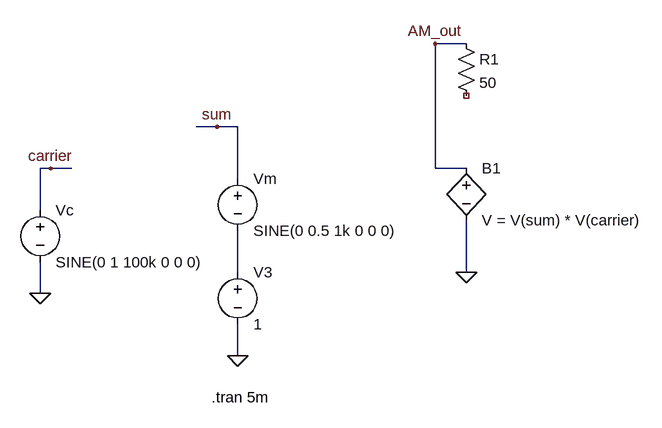
[diagram p0: schematic exp9.asc]
exp9.asc, the LTspice schematic file:
Version 4.1
SHEET 1 1004 680
WIRE 704 -160 656 -160
WIRE 320 -32 288 -32
WIRE 352 -32 320 -32
WIRE 64 32 48 32
WIRE 96 32 64 32
WIRE 656 32 656 -160
WIRE 704 32 656 32
WIRE 352 48 352 -32
WIRE 48 96 48 32
WIRE 352 192 352 128
WIRE 704 192 704 112
WIRE 48 224 48 176
WIRE 352 320 352 272
FLAG 48 224 0
FLAG 64 32 carrier
FLAG 352 320 0
FLAG 320 -32 sum
FLAG 656 -160 AM_out
FLAG 704 192 0
SYMBOL voltage 48 80 R0
WINDOW 123 0 0 Left 0
WINDOW 39 0 0 Left 0
SYMATTR InstName Vc
SYMATTR Value SINE(0 1 100k 0 0 0)
SYMBOL voltage 352 32 R0
WINDOW 123 0 0 Left 0
WINDOW 39 0 0 Left 0
SYMATTR InstName Vm
SYMATTR Value SINE(0 0.5 1k 0 0 0)
SYMBOL voltage 352 176 R0
WINDOW 123 0 0 Left 0
WINDOW 39 0 0 Left 0
SYMATTR InstName V3
SYMATTR Value 1
SYMBOL bv 704 16 R0
SYMATTR InstName B1
SYMATTR Value V = V(sum) * V(carrier)
SYMBOL res 688 -176 R0
SYMATTR InstName R1
SYMATTR Value 50
TEXT 312 384 Left 2 !.tran 5m

The netlist it stands for:
* exp9.asc
Vc carrier 0 SINE(0 1 100k 0 0 0)
Vm sum N001 SINE(0 0.5 1k 0 0 0)
V3 N001 0 1
B1 AM_out 0 V = V(sum) * V(carrier)
R1 AM_out NC_01 50
.tran 5m
.backanno
.end